# EAGLE design probe (EAGLE 7.5.0)
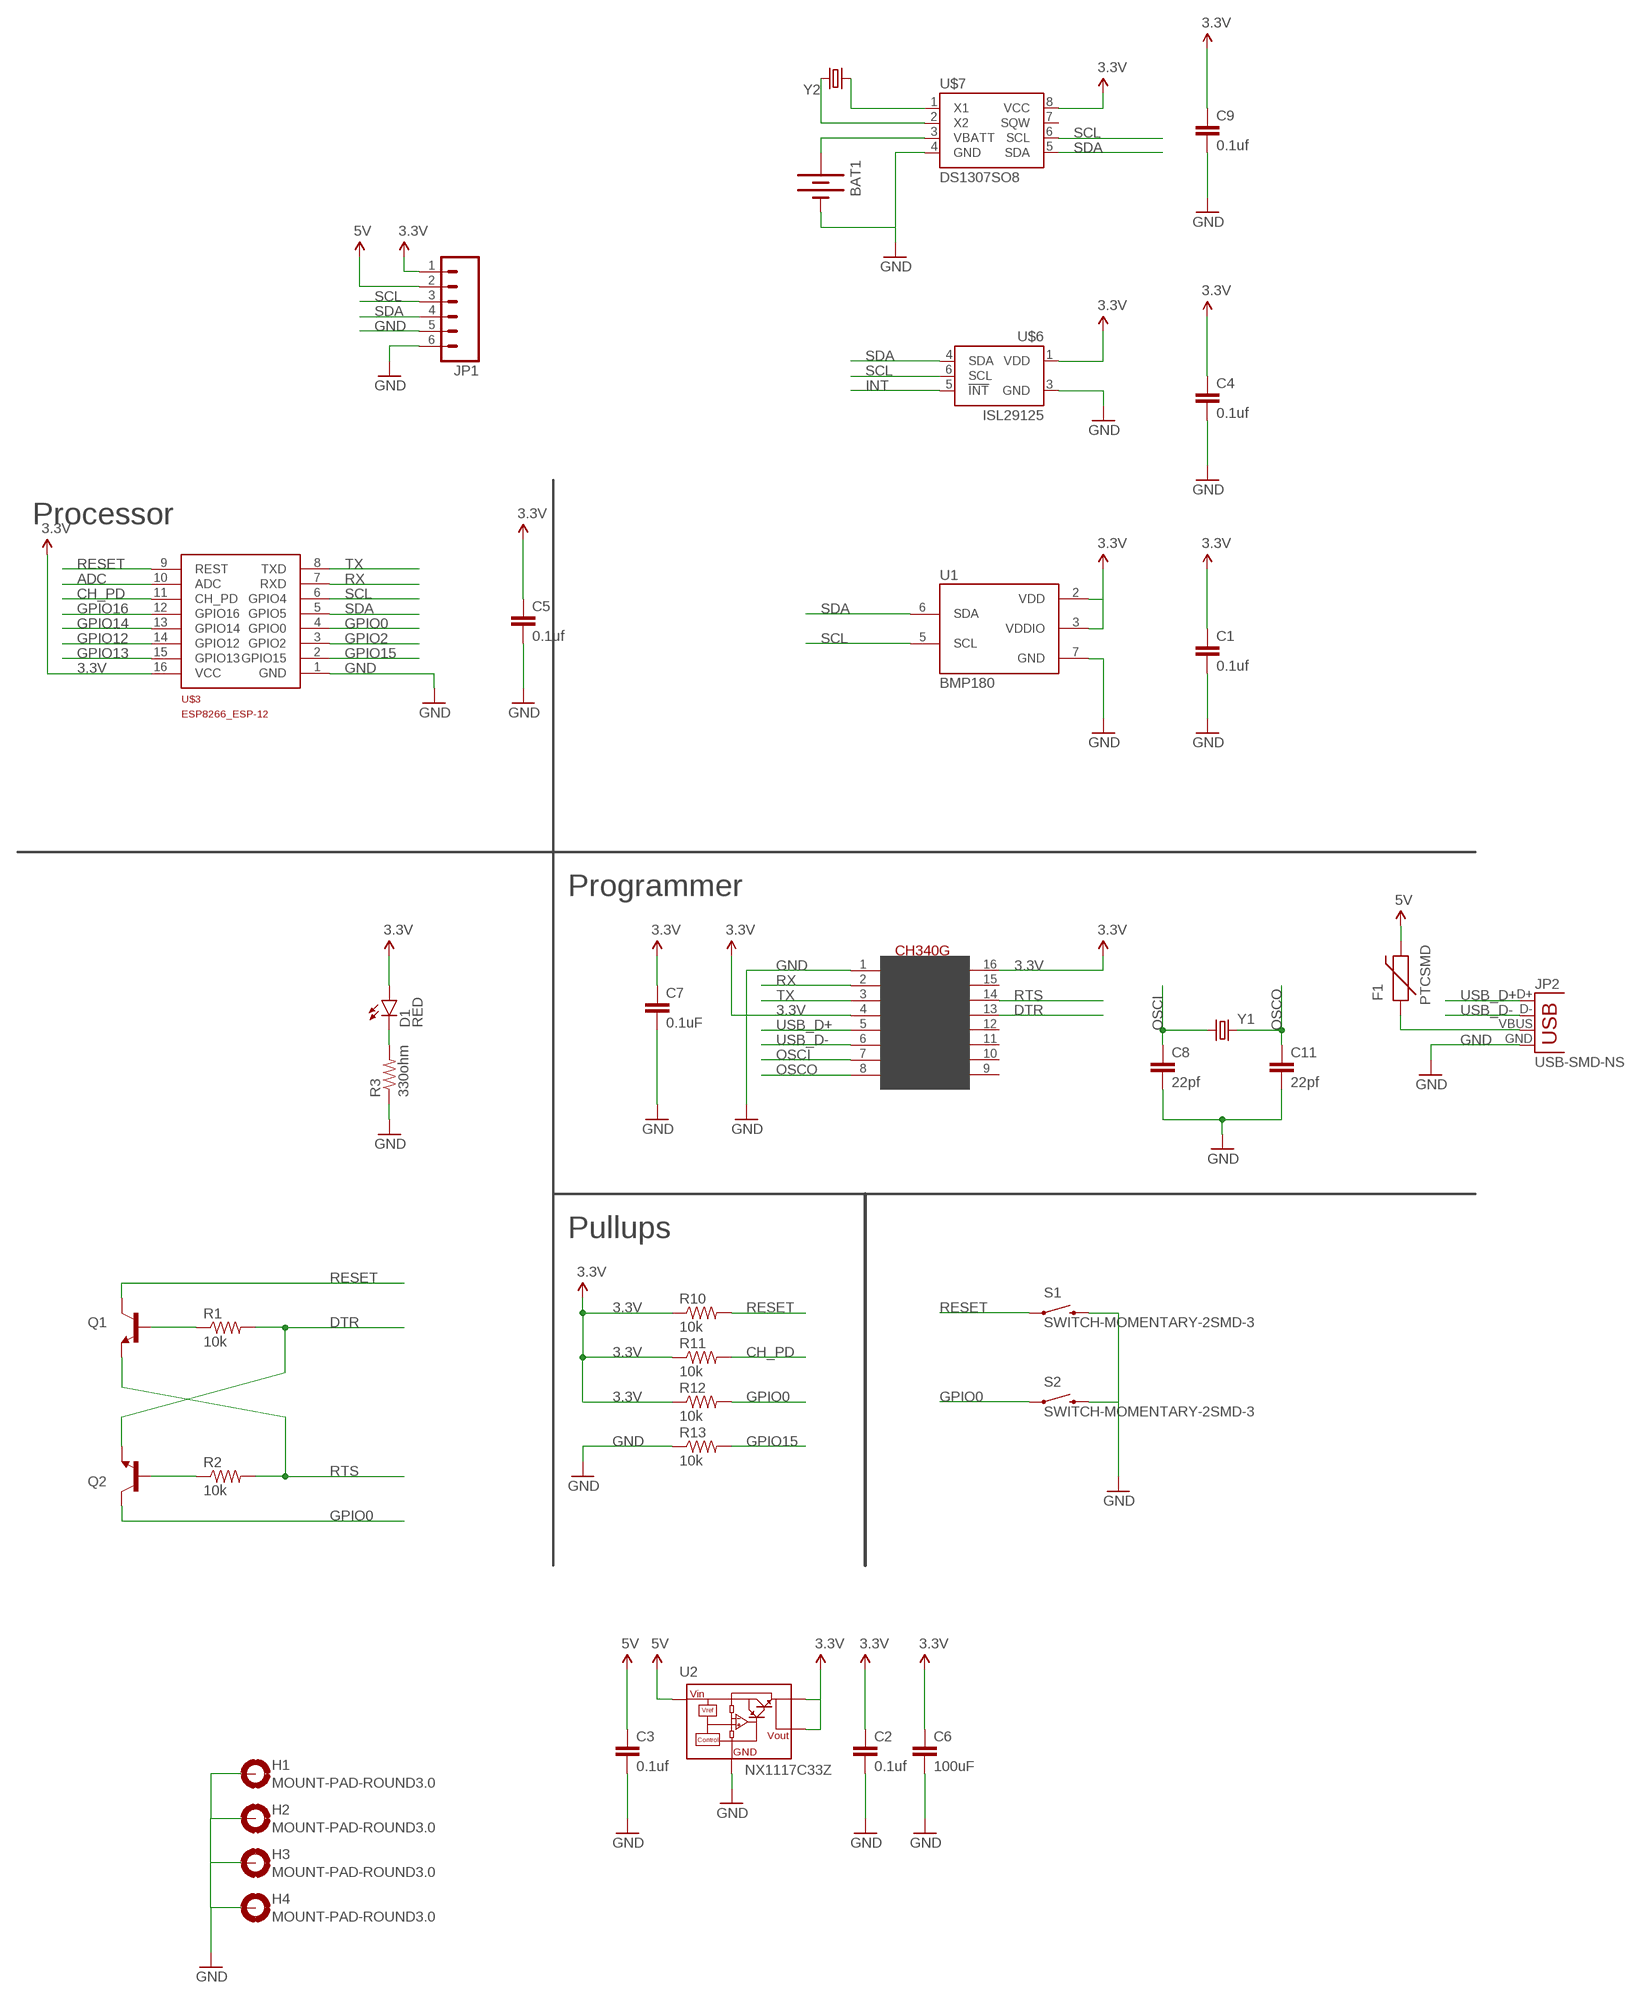
[diagram p0: schematic, sheet 1]

## Parts
BAT1  BATTERY12MM  [BATTCON_12MM]
C1  0.1uf  CAP1206  [1206]
C2  0.1uf  CAP1206  [1206]
C3  0.1uf  CAP1206  [1206]
C4  0.1uf  CAP1206  [1206]
C5  0.1uf  CAP1206  [1206]
C6  100uF  100UF6.3V20%(1210)  [1210]
C7  0.1uF  CAP1206  [1206]
C8  22pf  CAP1206  [1206]
C9  0.1uf  CAP1206  [1206]
C11  22pf  CAP1206  [1206]
D1  RED  LED-RED1206  [LED-1206]
F1  PTCSMD  [PTC-1206]
H1  MOUNT-PAD-ROUND3.0  [3,0-PAD]
H2  MOUNT-PAD-ROUND3.0  [3,0-PAD]
H3  MOUNT-PAD-ROUND3.0  [3,0-PAD]
H4  MOUNT-PAD-ROUND3.0  [3,0-PAD]
JP1  M06SMD-1MM  [1X06-1MM]
JP2  USB-SMD-NS  [USB-MINIB-NOSTOP]
Q1  TRANSISTOR_NPNSOT23-3  [SOT23-3]
Q2  TRANSISTOR_NPNSOT23-3  [SOT23-3]
R1  10k  RESISTOR1206  [1206]
R2  10k  RESISTOR1206  [1206]
R3  330ohm  RESISTOR1206  [1206]
R10  10k  RESISTOR1206  [1206]
R11  10k  RESISTOR1206  [1206]
R12  10k  RESISTOR1206  [1206]
R13  10k  RESISTOR1206  [1206]
S1  SWITCH-MOMENTARY-2SMD-3  [TACTILE_SWITCH_SMD-3]
S2  SWITCH-MOMENTARY-2SMD-3  [TACTILE_SWITCH_SMD-3]
U1  BMP180  [BMP180]
U2  NX1117C33Z  [SOT223]
U$2  CH340G  [SOIC16]
U$3  ESP8266_ESP-12  [ESP8266-ESP12]
U$6  ISL29125  [ODFN-LD-6]
U$7  DS1307SO8  [SO08]
Y1  CRYSTALSMD  [HC49UP]
Y2  CRYSTALTC38H  [TC38H]

## Nets
3.3V: C1.1 C2.1 C4.1 C5.1 C6.1 C7.1 C9.1 D1.A JP1.1 R10.1 R11.1 R12.1 U1.2(VDD) U1.3(VDDIO) U2.2(VOUT1) U2.4(VOUT) U$2.4(V3) U$2.16(VCC) U$3.16(VCC) U$6.1(VDD) U$7.8(VCC)
5V: C3.1 F1.2 JP1.2 U2.3(VIN)
ADC: U$3.10(ADC)
CH_PD: R11.2 U$3.11(CH_PD)
DTR: Q2.2(E) R1.2 U$2.13(DTR)
GND: BAT1.GND(-) C1.2 C2.2 C3.2 C4.2 C5.2 C6.2 C7.2 C8.2 C9.2 C11.2 H1.B3,0(MOUNT) H2.B3,0(MOUNT) H3.B3,0(MOUNT) H4.B3,0(MOUNT) JP1.5 JP1.6 JP2.GND R3.1 R13.1 S1.4 S2.4 U1.7(GND) U2.1(GND) U$2.1(GND) U$3.1(GND) U$6.3(GND) U$7.4(GND)
GPIO0: Q2.3(C) R12.2 S2.1 U$3.4(GPIO0)
GPIO2: U$3.3(GPIO2)
GPIO12: U$3.14(GPIO12)
GPIO13: U$3.15(GPIO13)
GPIO14: U$3.13(GPIO14)
GPIO15: R13.2 U$3.2(GPIO15)
GPIO16: U$3.12(GPIO16)
INT: U$6.5(!INT)
N$1: F1.1 JP2.VBUS
N$2: Q1.1(B) R1.1
N$3: BAT1.PWR@1(+) U$7.3(VBATT)
N$4: U$7.2(X2) Y2.2
N$5: Q2.1(B) R2.1
N$6: U$7.1(X1) Y2.1
N$7: D1.C R3.2
OSCI: C8.1 U$2.7(XI) Y1.1
OSCO: C11.1 U$2.8(XO) Y1.2
RESET: Q1.3(C) R10.2 S1.1 U$3.9(REST)
RTS: Q1.2(E) R2.2 U$2.14(RTS)
RX: U$2.2(TX) U$3.7(RXD)
SCL: JP1.3 U1.5(SCL) U$3.6(GPIO4) U$6.6(SCL) U$7.6(SCL)
SDA: JP1.4 U1.6(SDA) U$3.5(GPIO5) U$6.4(SDA) U$7.5(SDA)
TX: U$2.3(RX) U$3.8(TXD)
USB_D+: JP2.D+ U$2.5(D+)
USB_D-: JP2.D- U$2.6(D-)
Unconnected: U$2.9(CTS) U$2.10(DSR) U$2.11(RI) U$2.12(DCD) U$2.15(RS232) U$7.7(SQW)

## Notes on the sheet
- Processor
- Programmer
- Pullups

## Library data of the parts
BAT1 = SparkFun-Electromechanical:BATTERY: Battery Holders Various common sizes : AA, AAA, 18650 (PRT-12895), 20mm coin cell and 12mm coin cell. 20MM_4LEGS, BATT-10373; PROD_ID: BATT-08044
C1-C5 C7-C9 C11 = SparkFun-Capacitors:CAP: Capacitor Standard 0603 ceramic capacitor, and 0.1" leaded capacitor.
C6 = SparkFun-Capacitors:100UF6.3V20%(1210): CAP-09827; PROD_ID: CAP-09827
D1 = SparkFun-LED:LED-RED: Assorted Red LEDs LilyPad 1206- DIO-09912 1206- DIO-00809 0603- DIO-00819; PROD_ID: DIO-00809
F1 = SparkFun-PowerIC:PTC: Resettable Fuse PTC Resettable Fuse. Spark Fun Electronics SKU : COM-08357; PROD_ID: RES-11150
H1-H4 = holes:MOUNT-PAD-ROUND: MOUNTING PAD, round
JP1 = SparkFun-Connectors:M06: Header 6 Standard 6-pin 0.1" header. Use with straight break away headers (SKU : PRT-00116), right angle break away headers (PRT-00553), swiss pins (PRT-00743), machine pins (PRT-00117), and female headers (PRT-00115). Molex polarized connector foot print use with SKU : PRT-08094 with associated crimp pins and housings. NOTES ON THE VARIANTS LOCK and LOCK_LONGPADS... This footprint was designed to help hold the alignment of a through-hole component (i.e. 6-pin header) while soldering it into place. You may notice that each hole has been shifted either up or down by 0.005 of an inch from it's more standard position (which is a perfectly straight line). This slight alteration caused the pins (the squares in the middle) to touch the edges of the holes. Because they are alternating, it causes a "brace" to hold the component in place. 0.005 has proven to be the perfect amount of "off-center" position when using our standard breakaway headers. Although looks a little odd when you look at the bare footprint, once you have a header in there, the alteration is very hard to notice. Also,if you push a header all the way into place, it is covered up entirely on the bottom side. This idea of altering the position of holes to aid alignment will be further integrated into the Sparkfun Library for other footprints. It can help hold any component with 3 or more connection pins.
JP2 = SparkFun-Connectors:USB: USB Connectors USB-B-PTH is fully proven SKU : PRT-00139/CONN-08278 USB-miniB is fully proven SKU : PRT-00587 USB-A-PCB is untested. USB-A-H is throughly reviewed, but untested. Spark Fun Electronics SKU : PRT-00437 USB-B-SMT is throughly reviewed, but untested. Needs silkscreen touching up. USB-A-S has not been used/tested USB-MB-H has not been used/tested USB-MICROB has been used. CONN-09505
Q1 Q2 = SparkFun-DiscreteSemi:TRANSISTOR_NPN: Generic NPN BJT MMBT2222A - TRANS-08049 (SOT-23, 1A 40V) MPSA42 - TRANS-09116 (SOT-23, 500mA 300V) MMBT5088LT1G - TRANS-11160 (SOT-23, 50 mA 30V) BC547 - COM-08928 <http://www.sparkfun.com/products/8928> (TO-92 45V 100mA) (1.Collector 2.Base 3.Emitter) 2N3904 - COM-00521 <http://www.sparkfun.com/products/521> (TO-92 40V 200mA) (1.Emitter 2.Base 3.Collector) P2N2222A - COM-12852 <http://www.sparkfun.com/products/12852> (TO-92 40V 600mA) (1.Collector 2.Base 3.Emitter); PROD_ID: TRANS-08049
R1-R3 R10-R13 = SparkFun-Resistors:RESISTOR: Resistor Basic schematic elements and footprints for 0603, 1206, and PTH resistors.
S1 S2 = SparkFun-Electromechanical:SWITCH-MOMENTARY-2: Various NO switches- pushbuttons, reed, etc
U1 = SparkFun-Sensors:BMP180: BOSCH BMP180 DIGITAL BAROMETRIC PRESSURE SENSOR Web page: http://www.bosch-sensortec.com/en/homepage/products_3/environmental_sensors_1/bmp180_1/bmp180 Datasheet: http://ae-bst.resource.bosch.com/media/products/dokumente/bmp180/BST-BMP180-DS000-09.pdf The BMP180 is the function compatible successor of the BMP085, a new generation of high precision digital pressure sensors for consumer applications. The ultra-low power, low voltage electronics of the BMP180 is optimized for use in mobile phones, PDAs, GPS navigation devices and outdoor equipment. With a low altitude noise of merely 0.25m at fast conversion time, the BMP180 offers superior performance. The I2C interface allows for easy system integration with a microcontroller. The BMP180 is based on piezo-resistive technology for EMC robustness, high accuracy and linearity as well as long term stability. Key features: - Temperature measurement included - I2C interface - Fully calibrated - Pb-free, halogen-free and RoHS compliant, - MSL 1 Basic specs: Pressure range: 300 to 1100hPa (+9000m to -500m relating to sea level) Supply voltage: 1.8 to 3.6V (VDD), 1.62V to 3.6V (VDDIO) Package: LGA package with metal lid Small footprint: 3.6mm x 3.8mm Super-flat: 0.93mm height Low power: 5μA at 1 sample / sec. in standard mode Low noise: 0.06hPa (0.5m) in ultra low power mode, 0.02hPa (0.17m) advanced resolution mode Typical applications: - Enhancement of GPS navigation (dead-reckoning, slope detection, etc.) - In- and out-door navigation - Leisure and sports - Weather forecast - Vertical velocity indication (rise/sink speed)
U2 = nxp_60:NX1117C: The NX1117C/NX1117CE are two series of low-dropout positive voltage regulators with an output current capability of 1 A. AAL Eindhoven MK; 12NC: 9352 914 42115; TOLERANCE: 1.25%; VOLTAGE: 5.0V
U$2 = CH340G-USB-SERIAL:CH340G
U$3 = ESP8266-ESP12:ESP8266_ESP-12
U$6 = SparkFun-Sensors:ISL29125: The ISL29125 is a low power, high sensitivity RGB color light sensor with an I2C interface.
U$7 = SparkFun-FreqCtrl:DS1307: I2C real-time clock with battery backup.
Y1 Y2 = SparkFun-FreqCtrl:CRYSTAL: Various standard crystals. Proven footprints.

## Board
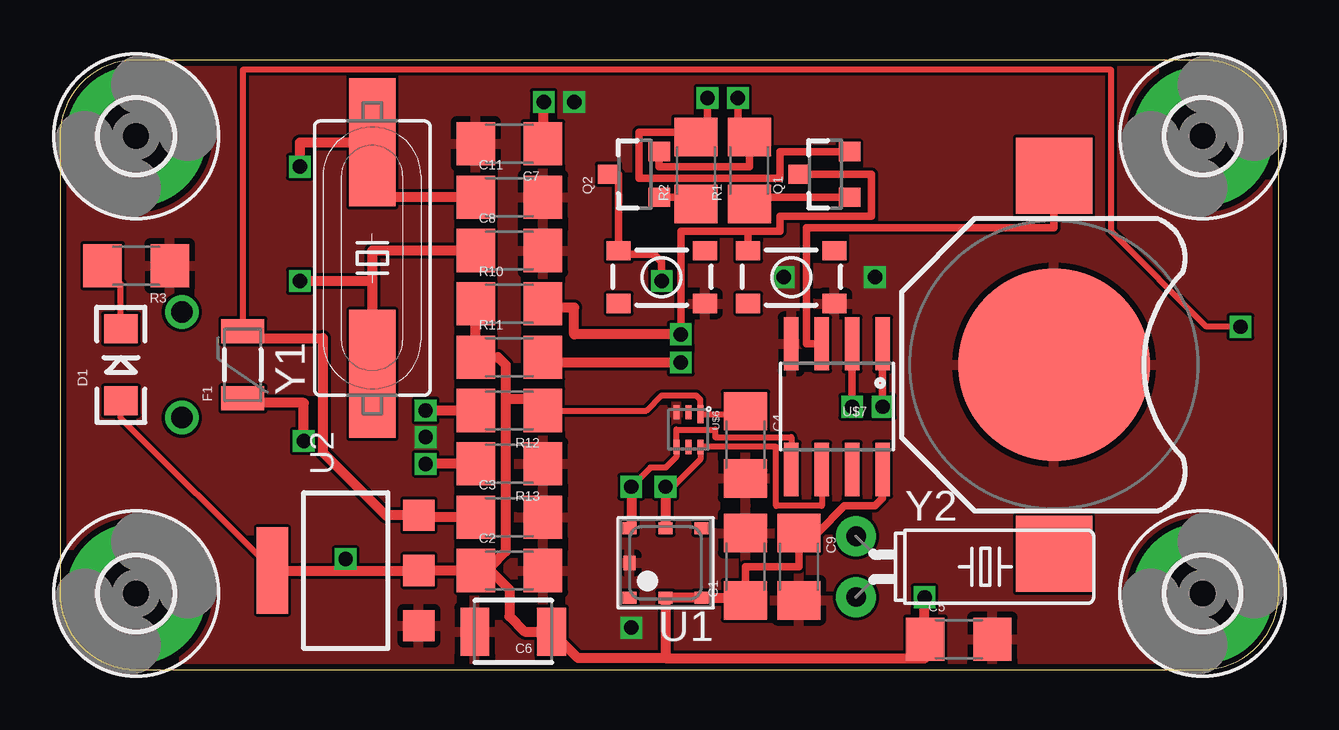
[diagram p1: board, top side]
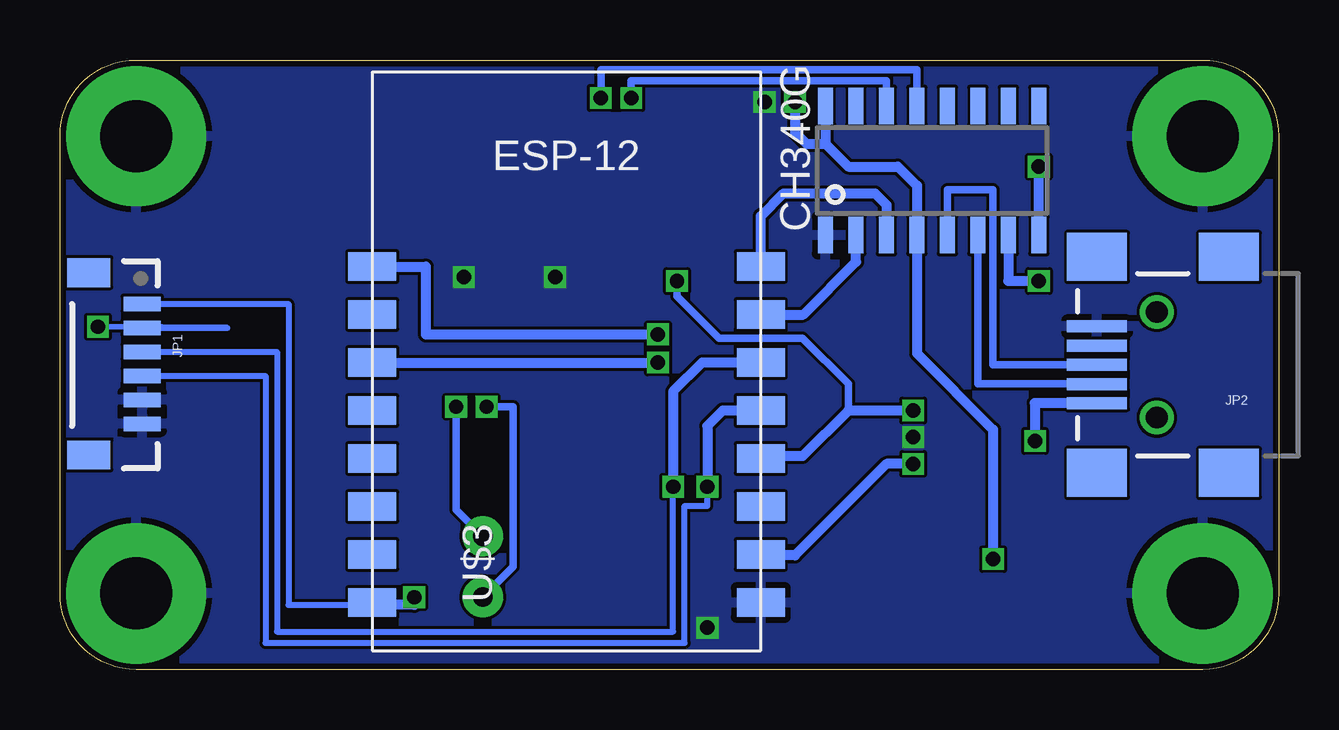
[diagram p2: board, bottom side, seen from below]

Size 50.8 x 25.4 mm. Coordinates in mm from the lower left corner, seen from the top.
Outline: 3.17,0 47.62,0 arc90 50.8,3.17 50.8,22.23 arc90 47.62,25.4 3.17,25.4 arc90 0,22.23 0,3.17 arc90 3.17,0
Copper layers (1*16): Top 0.035mm / dielectric 1.5mm / Bottom 0.035mm
Design rules "dirtypcbs": minimum track width 5mil, minimum drill 12mil, track to track 5mil, track to pad 5mil, pad to pad 5mil, via to via 5mil, smd to smd 0mil, copper to edge 10mil, drill to drill 10mil, minimum pad ring 10mil, minimum via ring 6mil, stop-mask expansion 2mil, vias tented up to drill 25mil, thermal gap 10mil

### Footprints (pad centres in the part's own frame; a part is rotated, then mirrored left to right if it is on the bottom)
BATTCON_12MM = smd 8 x 8: GND 0,0 | smd 3.175 x 3.175: PWR@1 -7.874,0; PWR@2 7.874,0
1206 = smd 1.6 x 1.8: 1 -1.4,0; 2 1.4,0
1210 = smd 1.2 x 2: 1 -1.6,0; 2 1.6,0
LED-1206 = smd 1.2 x 1.4: A -1.5,0; C 1.5,0
PTC-1206 = smd 1 x 1.8: 1 -1.4,0; 2 1.4,0
3,0-PAD = drill 3 pad 5.842: B3,0 0,0
1X06-1MM = smd 0.6 x 1.55: 1 -2.54,1.27; 2 -1.54,1.27; 3 -0.54,1.27; 4 0.46,1.27; 5 1.46,1.27; 6 2.46,1.27 | smd 1.2 x 1.8: P$1 -3.84,-0.955; P$2 3.76,-0.955
USB-MINIB-NOSTOP = smd 2.5 x 0.5: D+ 2.5,0; D- 2.5,0.8; GND 2.5,-1.6; ID 2.5,-0.8; VBUS 2.5,1.6 | smd 2.5 x 2: G1 -3,-4.5; G2 -3,4.5; G3 2.5,4.5; G4 2.5,-4.5 | drill 0.9 pad 0.8: H1 0,2.2 | drill 0.9 pad 0.787: H2 0,-2.2
SOT23-3 = smd 0.8 x 0.9: 1 -0.95,-1; 2 0.95,-1; 3 0,1.1
TACTILE_SWITCH_SMD-3 = smd 1 x 0.8: 1 -1.8,1.1; 2 1.8,1.1; 3 -1.8,-1.1; 4 1.8,-1.1
BMP180 = smd 0.6 x 0.5: 1 1.5,1.45; 2 0,1.45; 3 -1.5,1.45; 4 -1.5,-1.45; 5 0,-1.45; 6 1.5,-1.45 | smd 0.5 x 0.6: 7 1.5,0
SOT223 = smd 1.3 x 1.3: 1 -2.3,-3.05; 2 0,-3.05; 3 2.3,-3.05 | smd 3.6 x 1.3: 4 0,3.05
SOIC16 = smd 0.635 x 1.524: 1 -4.445,-2.695; 2 -3.175,-2.695; 3 -1.905,-2.695; 4 -0.635,-2.695; 5 0.635,-2.695; 6 1.905,-2.695; 7 3.175,-2.695; 8 4.445,-2.695; 9 4.445,2.695; 10 3.175,2.695; 11 1.905,2.695; 12 0.635,2.695; 13 -0.635,2.695; 14 -1.905,2.695; 15 -3.175,2.695; 16 -4.445,2.695
ESP8266-ESP12 = smd 2 x 1.2: 1 16.2,2; 2 16.2,4; 3 16.2,6; 4 16.2,8; 5 16.2,10; 6 16.2,12; 7 16.2,14; 8 16.2,16; 9 0,16; 10 0,14; 11 0,12; 12 0,10; 13 0,8; 14 0,6; 15 0,4; 16 0,2
ODFN-LD-6 = smd 0.75 x 0.25: 1 -0.645,0.5 | smd 0.6 x 0.25: 2 -0.72,0; 3 -0.72,-0.5; 4 0.72,-0.5; 5 0.72,0; 6 0.72,0.5
SO08 = smd 0.61 x 2.21: 1 -1.905,-2.616; 2 -0.635,-2.616; 3 0.635,-2.616; 4 1.905,-2.616; 5 1.905,2.616; 6 0.635,2.616; 7 -0.635,2.616; 8 -1.905,2.616
HC49UP = smd 5.334 x 1.93: 1 -4.826,0; 2 4.826,0
TC38H = drill 0.813 pad 1.676: 1 -1.27,0; 2 1.27,0

### Placement (x,y rotation side)
BAT1  41.43,12.7 270 top
C1  28.57,4.29 90 top
C2  18.73,4.13 0 top
C3  18.73,6.35 0 top
C4  28.57,9.37 270 top
C5  37.47,1.27 0 top
C6  18.89,1.59 180 top
C7  18.73,21.91 180 top
C8  18.73,17.46 0 top
C9  30.8,4.29 270 top
C11  18.73,19.68 0 top
D1  2.54,12.7 90 top
F1  7.62,12.7 90 top
H1  3.17,3.17 0 top
H2  3.17,22.23 0 top
H3  47.62,3.17 0 top
H4  47.62,22.23 0 top
JP1  48.64,12.7 270 bottom
JP2  5.08,12.7 180 bottom
Q1  31.91,20.64 90 top
Q2  23.97,20.64 90 top
R1  28.73,20.8 90 top
R2  26.51,20.8 90 top
R3  3.17,16.83 180 top
R10  18.73,15.24 0 top
R11  18.73,13.02 0 top
R12  18.73,10.79 180 top
R13  18.73,8.57 180 top
S1  30.48,16.35 0 top
S2  25.08,16.35 0 top
U1  25.24,4.45 180 top
U2  11.91,4.13 90 top
U$2  14.45,20.8 0 bottom
U$3  37.78,0.79 0 bottom
U$6  26.19,10 270 top
U$7  32.38,10.95 180 top
Y1  13.02,17.14 90 top
Y2  33.18,4.29 270 top

### Tracks (layer width: path | path; a pad name or v marks a point on that pad's centre or on a via)
3.3V  (via drill 0.6)
  Top 0.254: C4.1 28.54,10.65 U$6.1 26.69,11.25 26.51,11.43 25.08,11.43 24.45,10.79 R12.1 | U2.4 8.86,4.16 2.54,10.48 D1.A
  Top 0.305: 28.57,3 28.57,4.29 30.8,4.29 C9.1 31.56,5.69 32.7,6.83 33.97,6.83 34.29,7.14 U$7.8
  Top 0.406: U2.4 11.91,4.13 | 11.91,4.13 U2.2 C2.1 17.49,4.29 17.94,4.29 | 25.24,0.48 36.06,0.48 C5.1 36.04,1.27 v36.04,3.02 | 25.24,0.48 U1.2 U1.3 28.57,3 C1.1 | 20,10.79 R12.1 19.66,11.27 18.57,11.27 | 18.57,11.27 18.57,12.7 18.26,13.02 R11.1 R10.1 | 18.57,11.27 18.57,4.92 17.94,4.29 | v11.91,4.6 11.91,4.13 | C7.1 v20.16,23.65 | 25.24,0.48 21.6,0.48 C6.1 19.37,1.59 18.73,2.22 18.73,3.33 17.94,4.13 17.94,4.29
  Bottom 0.254: JP1.1 41.27,15.24 41.27,2.7 37.78,2.7 U$3.16
  Bottom 0.406: U$2.16 18.89,21.91 | 18.89,21.91 17.94,20.95 15.88,20.95 15.08,20.16 U$2.4 15.08,13.18 11.91,10 v11.91,4.6 | v36.04,3.02 36.04,2.7 37.69,2.7 U$3.16 | v20.16,23.65 20.16,22.38 19.68,21.91 18.89,21.91
5V  (via drill 0.6)
  Top 0.254: v49.21,14.29 47.78,14.29 43.81,18.26 43.81,24.99 7.62,24.99 F1.2
  Top 0.406: C3.1 15.03,6.35 U2.3 13.57,6.43 10.95,9.05 10.95,13.81 7.62,13.81 F1.2
  Bottom 0.254: JP1.2 43.81,14.24 v49.21,14.29
CH_PD  (via drill 0.6)
  Top 0.406: v25.88,12.79 20.13,12.79 R11.2
  Bottom 0.406: 38.26,13.02 38.03,12.79 U$3.11 v25.88,12.79
DTR  (via drill 0.6)
  Top 0.305: Q2.2 24.97,20.95 28.73,20.95 R1.2 28.26,22.07 v28.26,23.81
  Bottom 0.305: U$2.13 15.08,24.99 28.26,24.99 v28.26,23.81
GND  (via drill 0.6)
  other vias: 15.24,9.68 30.16,16.35 33.97,16.35 23.81,1.75 21.43,23.65
  pour Top: 0,0 50.8,0 50.8,25.4 0,25.4
  pour Bottom: 50.8,0 50.8,25.4 0,25.4 0,0
GPIO0  (via drill 0.6)
  Top 0.305: Q2.3 23.28,20.64 S2.1 23.29,17.3 24.77,17.3 25.08,16.99 v25.08,16.19
  Top 0.406: R12.2 v15.24,10.79
  Bottom 0.305: 17.94,10.79 17.94,11.91 19.84,13.81 23.34,13.81 25.08,15.56 v25.08,16.19
  Bottom 0.406: v15.24,10.79 17.94,10.79 19.84,8.89 21.49,8.89 U$3.4
GPIO15  (via drill 0.6)
  Top 0.406: R13.2 v15.24,8.57
  Bottom 0.406: v15.24,8.57 16.35,8.57 20.16,4.76 21.55,4.76 U$3.2
N$1  (via drill 0.6)
  Top 0.406: v10.16,9.53 10.16,11.11 7.81,11.11 F1.1
  Bottom 0.406: JP2.VBUS 10.17,11.1 v10.16,9.53
N$2
  Top 0.305: Q1.1 28.73,19.69 R1.1
N$3
  Top 0.305: U$7.3 31.11,13.57 31.11,18.41 41.43,18.41 BAT1.PWR@1
N$4  (via drill 0.6)
  Top 0.305: U$7.2 v33.02,10.95
  Bottom 0.305: v33.02,10.95 31.91,10.95 31.91,4.29 Y2.2
N$5
  Top 0.305: Q2.1 26.51,19.69 R2.1
N$6  (via drill 0.6)
  Top 0.305: U$7.1 v34.29,10.95
  Bottom 0.305: v34.29,10.95 34.29,6.67 Y2.1
N$7
  Top 0.254: D1.C 2.54,16.06 R3.2
OSCI  (via drill 0.6)
  Top 0.406: v10,16.19 13.02,16.19 | 13.02,16.19 Y1.1 | C8.1 13.02,17.46 13.02,16.19
  Bottom 0.406: U$2.7 11.27,16.19 v10,16.19
OSCO  (via drill 0.6)
  Top 0.406: v10,20.95 10,21.97 Y1.2 13.02,19.68 C11.1
  Bottom 0.406: U$2.8 v10,20.95
RESET  (via drill 0.6)
  Top 0.305: Q1.3 33.81,20.64 33.81,18.89 30,18.89 30,18.26 28.68,18.26 | 28.68,18.26 25.88,18.26 v25.88,13.97 | S1.1 28.68,18.26
  Top 0.406: v25.88,13.97 21.43,13.97 21.43,15.08 20.13,15.08 R10.2
  Bottom 0.406: U$3.9 35.56,16.79 35.56,13.97 v25.88,13.97
RTS  (via drill 0.6)
  Top 0.305: Q1.2 30,21.59 30,20.48 24.13,20.48 24.13,22.38 26.51,22.38 R2.2 26.99,22.04 v26.99,23.81
  Bottom 0.305: U$2.14 16.35,24.53 26.99,24.53 v26.99,23.81
RX
  Bottom 0.406: U$3.7 19.81,14.79 17.62,16.99 U$2.2
SCL  (via drill 0.6)
  Top 0.254: v25.24,7.62 25.56,7.62 26.69,8.76 U$6.6 29.84,9.28 29.84,6.83 31.75,6.83 U$7.6
  Top 0.406: v25.24,7.62 U1.5
  Bottom 0.254: v25.24,7.62 25.24,1.59 41.75,1.59 41.75,13.24 JP1.3
  Bottom 0.406: U$3.6 24.04,12.79 25.24,11.59 v25.24,7.62
SDA  (via drill 0.6)
  Top 0.254: v23.81,7.62 24.61,8.41 25.24,8.41 25.69,8.87 U$6.4 25.69,10 27.3,10 27.3,9.68 30.48,9.68 U$7.5
  Top 0.406: v23.81,7.62 23.81,5.97 U1.6
  Bottom 0.254: JP1.4 42.23,12.24 42.23,1.11 24.77,1.11 24.77,6.83 23.81,6.83 v23.81,7.62
  Bottom 0.406: U$3.5 23.18,10.79 23.81,10.16 v23.81,7.62
TX
  Bottom 0.406: U$3.8 21.58,18.9 20.64,19.84 16.83,19.84 16.35,19.37 U$2.3
USB_D+
  Bottom 0.305: JP2.D+ 11.91,12.7 11.91,20 13.81,20 U$2.5
USB_D-
  Bottom 0.305: JP2.D- 12.54,11.9 U$2.6